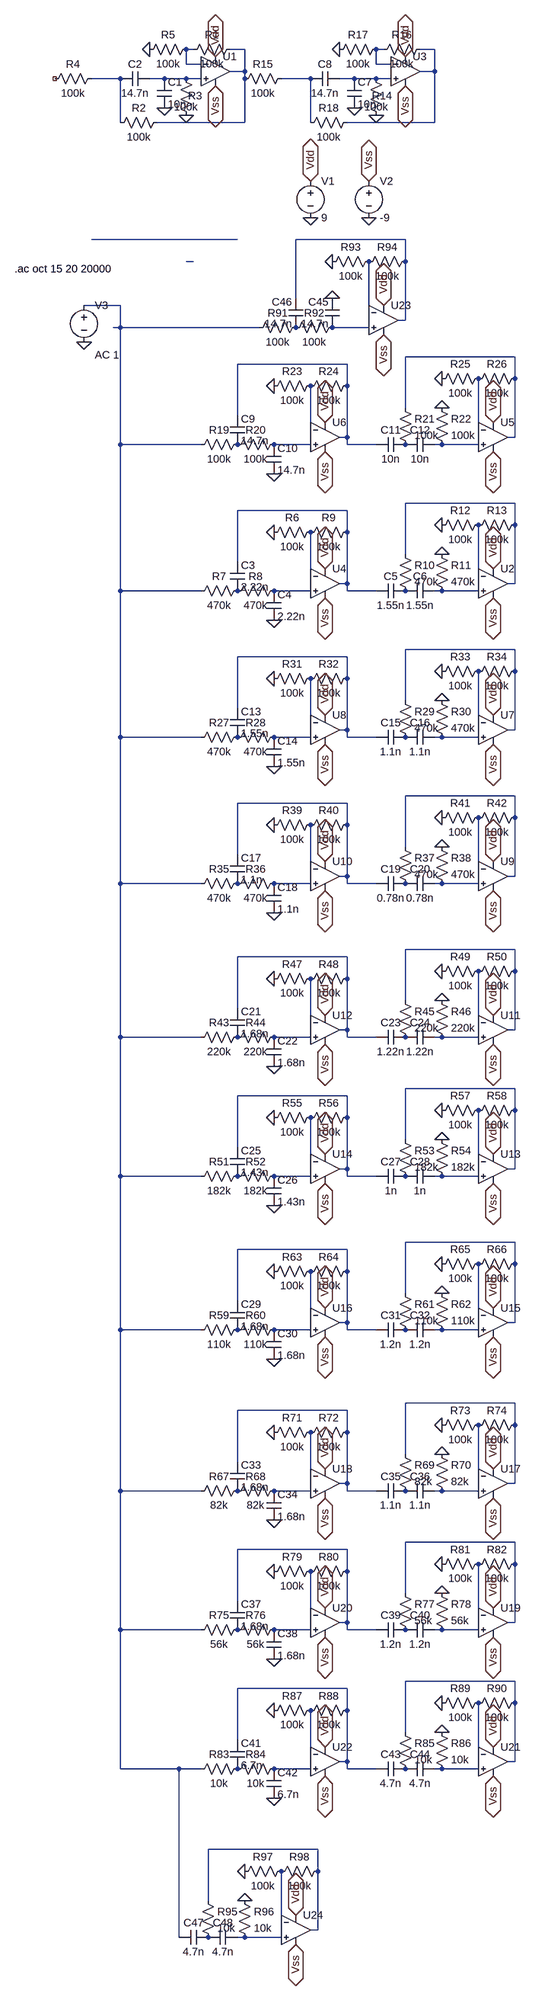
[diagram p0: schematic VocoderFilter.asc]
VocoderFilter.asc, the LTspice schematic file:
Version 4
SHEET 1 1012 3860
WIRE 48 -384 32 -384
WIRE 160 -384 128 -384
WIRE 464 -384 448 -384
WIRE 576 -384 544 -384
WIRE 32 -352 32 -384
WIRE 64 -352 32 -352
WIRE 448 -352 448 -384
WIRE 480 -352 448 -352
WIRE 160 -336 160 -384
WIRE 160 -336 128 -336
WIRE 576 -336 576 -384
WIRE 576 -336 544 -336
WIRE -112 -320 -176 -320
WIRE -16 -320 -48 -320
WIRE 32 -320 -16 -320
WIRE 64 -320 32 -320
WIRE 160 -320 160 -336
WIRE 304 -320 240 -320
WIRE 400 -320 368 -320
WIRE 448 -320 400 -320
WIRE 480 -320 448 -320
WIRE -112 -224 -112 -320
WIRE 160 -224 160 -320
WIRE 160 -224 -32 -224
WIRE 304 -224 304 -320
WIRE 576 -224 576 -336
WIRE 576 -224 384 -224
WIRE 144 32 -176 32
WIRE 512 32 272 32
WIRE 48 80 32 80
WIRE 512 80 512 32
WIRE 272 160 272 32
WIRE -112 176 -192 176
WIRE 432 192 432 80
WIRE 512 208 512 80
WIRE 512 208 496 208
WIRE -112 224 -112 176
WIRE -112 224 -128 224
WIRE 192 224 -112 224
WIRE 432 224 352 224
WIRE 752 288 512 288
WIRE 384 304 144 304
WIRE 752 336 752 288
WIRE 384 352 384 304
WIRE 512 400 512 288
WIRE 144 416 144 304
WIRE 304 448 304 352
WIRE 672 448 672 336
WIRE 384 464 384 352
WIRE 384 464 368 464
WIRE 752 464 752 336
WIRE 752 464 736 464
WIRE -112 480 -112 224
WIRE 64 480 -112 480
WIRE 304 480 224 480
WIRE 384 480 384 464
WIRE 448 480 384 480
WIRE 592 480 576 480
WIRE 672 480 592 480
WIRE 752 608 512 608
WIRE 384 624 144 624
WIRE 752 656 752 608
WIRE 384 672 384 624
WIRE 512 720 512 608
WIRE 144 736 144 624
WIRE 304 768 304 672
WIRE 672 768 672 656
WIRE 384 784 384 672
WIRE 384 784 368 784
WIRE 752 784 752 656
WIRE 752 784 736 784
WIRE -112 800 -112 480
WIRE 64 800 -112 800
WIRE 304 800 224 800
WIRE 384 800 384 784
WIRE 448 800 384 800
WIRE 592 800 576 800
WIRE 672 800 592 800
WIRE 752 928 512 928
WIRE 384 944 144 944
WIRE 752 976 752 928
WIRE 384 992 384 944
WIRE 512 1040 512 928
WIRE 144 1056 144 944
WIRE 304 1088 304 992
WIRE 672 1088 672 976
WIRE 384 1104 384 992
WIRE 384 1104 368 1104
WIRE 752 1104 752 976
WIRE 752 1104 736 1104
WIRE -112 1120 -112 800
WIRE 64 1120 -112 1120
WIRE 304 1120 224 1120
WIRE 384 1120 384 1104
WIRE 448 1120 384 1120
WIRE 592 1120 576 1120
WIRE 672 1120 592 1120
WIRE 752 1248 512 1248
WIRE 384 1264 144 1264
WIRE 752 1296 752 1248
WIRE 384 1312 384 1264
WIRE 512 1360 512 1248
WIRE 144 1376 144 1264
WIRE 304 1408 304 1312
WIRE 672 1408 672 1296
WIRE 384 1424 384 1312
WIRE 384 1424 368 1424
WIRE 752 1424 752 1296
WIRE 752 1424 736 1424
WIRE -112 1440 -112 1120
WIRE 64 1440 -112 1440
WIRE 304 1440 224 1440
WIRE 384 1440 384 1424
WIRE 448 1440 384 1440
WIRE 592 1440 576 1440
WIRE 672 1440 592 1440
WIRE 752 1584 512 1584
WIRE 384 1600 144 1600
WIRE 752 1632 752 1584
WIRE 384 1648 384 1600
WIRE 512 1696 512 1584
WIRE 144 1712 144 1600
WIRE 304 1744 304 1648
WIRE 672 1744 672 1632
WIRE 384 1760 384 1648
WIRE 384 1760 368 1760
WIRE 752 1760 752 1632
WIRE 752 1760 736 1760
WIRE -112 1776 -112 1440
WIRE 64 1776 -112 1776
WIRE 304 1776 224 1776
WIRE 384 1776 384 1760
WIRE 448 1776 384 1776
WIRE 592 1776 576 1776
WIRE 672 1776 592 1776
WIRE 752 1888 512 1888
WIRE 384 1904 144 1904
WIRE 752 1936 752 1888
WIRE 384 1952 384 1904
WIRE 512 2000 512 1888
WIRE 144 2016 144 1904
WIRE 304 2048 304 1952
WIRE 672 2048 672 1936
WIRE 384 2064 384 1952
WIRE 384 2064 368 2064
WIRE 752 2064 752 1936
WIRE 752 2064 736 2064
WIRE -112 2080 -112 1776
WIRE 64 2080 -112 2080
WIRE 304 2080 224 2080
WIRE 384 2080 384 2064
WIRE 448 2080 384 2080
WIRE 592 2080 576 2080
WIRE 672 2080 592 2080
WIRE 752 2224 512 2224
WIRE 384 2240 144 2240
WIRE 752 2272 752 2224
WIRE 384 2288 384 2240
WIRE 512 2336 512 2224
WIRE 144 2352 144 2240
WIRE 304 2384 304 2288
WIRE 672 2384 672 2272
WIRE 384 2400 384 2288
WIRE 384 2400 368 2400
WIRE 752 2400 752 2272
WIRE 752 2400 736 2400
WIRE -112 2416 -112 2080
WIRE 64 2416 -112 2416
WIRE 304 2416 224 2416
WIRE 384 2416 384 2400
WIRE 448 2416 384 2416
WIRE 592 2416 576 2416
WIRE 672 2416 592 2416
WIRE 752 2576 512 2576
WIRE 384 2592 144 2592
WIRE 752 2624 752 2576
WIRE 384 2640 384 2592
WIRE 512 2688 512 2576
WIRE 144 2704 144 2592
WIRE 304 2736 304 2640
WIRE 672 2736 672 2624
WIRE 384 2752 384 2640
WIRE 384 2752 368 2752
WIRE 752 2752 752 2624
WIRE 752 2752 736 2752
WIRE -112 2768 -112 2416
WIRE 64 2768 -112 2768
WIRE 304 2768 224 2768
WIRE 384 2768 384 2752
WIRE 448 2768 384 2768
WIRE 592 2768 576 2768
WIRE 672 2768 592 2768
WIRE 752 2880 512 2880
WIRE 384 2896 144 2896
WIRE 752 2928 752 2880
WIRE 384 2944 384 2896
WIRE 512 2992 512 2880
WIRE 144 3008 144 2896
WIRE 304 3040 304 2944
WIRE 672 3040 672 2928
WIRE 384 3056 384 2944
WIRE 384 3056 368 3056
WIRE 752 3056 752 2928
WIRE 752 3056 736 3056
WIRE -112 3072 -112 2768
WIRE 64 3072 -112 3072
WIRE 304 3072 224 3072
WIRE 384 3072 384 3056
WIRE 448 3072 384 3072
WIRE 592 3072 576 3072
WIRE 672 3072 592 3072
WIRE 752 3184 512 3184
WIRE 384 3200 144 3200
WIRE 752 3232 752 3184
WIRE 384 3248 384 3200
WIRE 512 3296 512 3184
WIRE 144 3312 144 3200
WIRE 304 3344 304 3248
WIRE 672 3344 672 3232
WIRE 384 3360 384 3248
WIRE 384 3360 368 3360
WIRE 752 3360 752 3232
WIRE 752 3360 736 3360
WIRE -112 3376 -112 3072
WIRE 16 3376 -112 3376
WIRE 64 3376 16 3376
WIRE 304 3376 224 3376
WIRE 384 3376 384 3360
WIRE 448 3376 384 3376
WIRE 592 3376 576 3376
WIRE 672 3376 592 3376
WIRE 320 3552 80 3552
WIRE 320 3600 320 3552
WIRE 80 3664 80 3552
WIRE 240 3712 240 3600
WIRE 320 3728 320 3600
WIRE 320 3728 304 3728
WIRE 16 3744 16 3376
WIRE 160 3744 144 3744
WIRE 240 3744 160 3744
FLAG 32 -240 0
FLAG -16 -256 0
FLAG 432 -16 0
FLAG 304 -16 0
FLAG -192 256 0
FLAG -48 -384 0
FLAG 304 -96 Vdd
IOPIN 304 -96 BiDir
FLAG 96 -304 Vss
IOPIN 96 -304 BiDir
FLAG 224 864 0
FLAG 592 720 0
FLAG 432 -96 Vss
IOPIN 432 -96 BiDir
FLAG 96 -368 Vdd
IOPIN 96 -368 BiDir
FLAG 448 -240 0
FLAG 400 -256 0
FLAG 368 -384 0
FLAG 512 -304 Vss
IOPIN 512 -304 BiDir
FLAG 512 -368 Vdd
IOPIN 512 -368 BiDir
FLAG 704 816 Vss
IOPIN 704 816 BiDir
FLAG 704 752 Vdd
IOPIN 704 752 BiDir
FLAG 336 816 Vss
IOPIN 336 816 BiDir
FLAG 336 752 Vdd
IOPIN 336 752 BiDir
FLAG 592 656 0
FLAG 224 672 0
FLAG 224 544 0
FLAG 592 400 0
FLAG 704 496 Vss
IOPIN 704 496 BiDir
FLAG 704 432 Vdd
IOPIN 704 432 BiDir
FLAG 336 496 Vss
IOPIN 336 496 BiDir
FLAG 336 432 Vdd
IOPIN 336 432 BiDir
FLAG 592 336 0
FLAG 224 352 0
FLAG 224 1184 0
FLAG 592 1040 0
FLAG 704 1136 Vss
IOPIN 704 1136 BiDir
FLAG 704 1072 Vdd
IOPIN 704 1072 BiDir
FLAG 336 1136 Vss
IOPIN 336 1136 BiDir
FLAG 336 1072 Vdd
IOPIN 336 1072 BiDir
FLAG 592 976 0
FLAG 224 992 0
FLAG 224 1504 0
FLAG 592 1360 0
FLAG 704 1456 Vss
IOPIN 704 1456 BiDir
FLAG 704 1392 Vdd
IOPIN 704 1392 BiDir
FLAG 336 1456 Vss
IOPIN 336 1456 BiDir
FLAG 336 1392 Vdd
IOPIN 336 1392 BiDir
FLAG 592 1296 0
FLAG 224 1312 0
FLAG 224 1840 0
FLAG 592 1696 0
FLAG 704 1792 Vss
IOPIN 704 1792 BiDir
FLAG 704 1728 Vdd
IOPIN 704 1728 BiDir
FLAG 336 1792 Vss
IOPIN 336 1792 BiDir
FLAG 336 1728 Vdd
IOPIN 336 1728 BiDir
FLAG 592 1632 0
FLAG 224 1648 0
FLAG 224 2144 0
FLAG 592 2000 0
FLAG 704 2096 Vss
IOPIN 704 2096 BiDir
FLAG 704 2032 Vdd
IOPIN 704 2032 BiDir
FLAG 336 2096 Vss
IOPIN 336 2096 BiDir
FLAG 336 2032 Vdd
IOPIN 336 2032 BiDir
FLAG 592 1936 0
FLAG 224 1952 0
FLAG 224 2480 0
FLAG 592 2336 0
FLAG 704 2432 Vss
IOPIN 704 2432 BiDir
FLAG 704 2368 Vdd
IOPIN 704 2368 BiDir
FLAG 336 2432 Vss
IOPIN 336 2432 BiDir
FLAG 336 2368 Vdd
IOPIN 336 2368 BiDir
FLAG 592 2272 0
FLAG 224 2288 0
FLAG 224 2832 0
FLAG 592 2688 0
FLAG 704 2784 Vss
IOPIN 704 2784 BiDir
FLAG 704 2720 Vdd
IOPIN 704 2720 BiDir
FLAG 336 2784 Vss
IOPIN 336 2784 BiDir
FLAG 336 2720 Vdd
IOPIN 336 2720 BiDir
FLAG 592 2624 0
FLAG 224 2640 0
FLAG 224 3136 0
FLAG 592 2992 0
FLAG 704 3088 Vss
IOPIN 704 3088 BiDir
FLAG 704 3024 Vdd
IOPIN 704 3024 BiDir
FLAG 336 3088 Vss
IOPIN 336 3088 BiDir
FLAG 336 3024 Vdd
IOPIN 336 3024 BiDir
FLAG 592 2928 0
FLAG 224 2944 0
FLAG 224 3440 0
FLAG 592 3296 0
FLAG 704 3392 Vss
IOPIN 704 3392 BiDir
FLAG 704 3328 Vdd
IOPIN 704 3328 BiDir
FLAG 336 3392 Vss
IOPIN 336 3392 BiDir
FLAG 336 3328 Vdd
IOPIN 336 3328 BiDir
FLAG 592 3232 0
FLAG 224 3248 0
FLAG 352 160 0
FLAG 464 240 Vss
IOPIN 464 240 BiDir
FLAG 464 176 Vdd
IOPIN 464 176 BiDir
FLAG 352 80 0
FLAG 160 3664 0
FLAG 272 3760 Vss
IOPIN 272 3760 BiDir
FLAG 272 3696 Vdd
IOPIN 272 3696 BiDir
FLAG 160 3600 0
SYMBOL res 48 -224 R180
WINDOW 0 -19 58 Left 2
WINDOW 3 -10 34 Left 2
SYMATTR InstName R3
SYMATTR Value 100k
SYMBOL cap -32 -320 R0
SYMATTR InstName C1
SYMATTR Value 10n
SYMBOL cap -48 -336 R90
WINDOW 0 0 32 VBottom 2
WINDOW 3 32 32 VTop 2
SYMATTR InstName C2
SYMATTR Value 14.7n
SYMBOL res -160 -336 R90
WINDOW 0 0 56 VBottom 2
WINDOW 3 32 56 VTop 2
SYMATTR InstName R4
SYMATTR Value 100k
SYMBOL voltage 304 -112 R0
WINDOW 123 0 0 Left 0
WINDOW 39 0 0 Left 0
SYMATTR InstName V1
SYMATTR Value 9
SYMBOL voltage 432 -112 R0
WINDOW 123 0 0 Left 0
WINDOW 39 0 0 Left 0
SYMATTR InstName V2
SYMATTR Value -9
SYMBOL voltage -192 160 R0
WINDOW 123 24 124 Left 2
WINDOW 39 0 0 Left 0
SYMATTR Value2 AC 1
SYMATTR InstName V3
SYMATTR Value ""
SYMBOL Opamps\\UniversalOpamp2 96 -336 R0
SYMATTR InstName U1
SYMBOL res 144 -400 R90
WINDOW 0 0 56 VBottom 2
WINDOW 3 32 56 VTop 2
SYMATTR InstName R1
SYMATTR Value 100k
SYMBOL res 48 -400 R90
WINDOW 0 0 56 VBottom 2
WINDOW 3 32 56 VTop 2
SYMATTR InstName R5
SYMATTR Value 100k
SYMBOL res -16 -240 R90
WINDOW 0 0 56 VBottom 2
WINDOW 3 32 56 VTop 2
SYMATTR InstName R2
SYMATTR Value 100k
SYMBOL cap 128 736 R0
SYMATTR InstName C3
SYMATTR Value 2.22n
SYMBOL res 160 784 R90
WINDOW 0 0 56 VBottom 2
WINDOW 3 32 56 VTop 2
SYMATTR InstName R7
SYMATTR Value 470k
SYMBOL cap 208 800 R0
SYMATTR InstName C4
SYMATTR Value 2.22n
SYMBOL res 240 784 R90
WINDOW 0 0 56 VBottom 2
WINDOW 3 32 56 VTop 2
SYMATTR InstName R8
SYMATTR Value 470k
SYMBOL res 496 704 R0
SYMATTR InstName R10
SYMATTR Value 470k
SYMBOL cap 512 784 R90
WINDOW 0 0 32 VBottom 2
WINDOW 3 32 32 VTop 2
SYMATTR InstName C5
SYMATTR Value 1.55n
SYMBOL cap 576 784 R90
WINDOW 0 0 32 VBottom 2
WINDOW 3 32 32 VTop 2
SYMATTR InstName C6
SYMATTR Value 1.55n
SYMBOL res 576 704 R0
SYMATTR InstName R11
SYMATTR Value 470k
SYMBOL res 464 -224 R180
WINDOW 0 -19 58 Left 2
WINDOW 3 -10 34 Left 2
SYMATTR InstName R14
SYMATTR Value 100k
SYMBOL cap 384 -320 R0
SYMATTR InstName C7
SYMATTR Value 10n
SYMBOL cap 368 -336 R90
WINDOW 0 0 32 VBottom 2
WINDOW 3 32 32 VTop 2
SYMATTR InstName C8
SYMATTR Value 14.7n
SYMBOL res 256 -336 R90
WINDOW 0 0 56 VBottom 2
WINDOW 3 32 56 VTop 2
SYMATTR InstName R15
SYMATTR Value 100k
SYMBOL Opamps\\UniversalOpamp2 512 -336 R0
SYMATTR InstName U3
SYMBOL res 560 -400 R90
WINDOW 0 0 56 VBottom 2
WINDOW 3 32 56 VTop 2
SYMATTR InstName R16
SYMATTR Value 100k
SYMBOL res 464 -400 R90
WINDOW 0 0 56 VBottom 2
WINDOW 3 32 56 VTop 2
SYMATTR InstName R17
SYMATTR Value 100k
SYMBOL res 400 -240 R90
WINDOW 0 0 56 VBottom 2
WINDOW 3 32 56 VTop 2
SYMATTR InstName R18
SYMATTR Value 100k
SYMBOL Opamps\\UniversalOpamp2 704 784 R0
SYMATTR InstName U2
SYMBOL Opamps\\UniversalOpamp2 336 784 R0
SYMATTR InstName U4
SYMBOL res 320 656 R90
WINDOW 0 0 56 VBottom 2
WINDOW 3 32 56 VTop 2
SYMATTR InstName R6
SYMATTR Value 100k
SYMBOL res 400 656 R90
WINDOW 0 0 56 VBottom 2
WINDOW 3 32 56 VTop 2
SYMATTR InstName R9
SYMATTR Value 100k
SYMBOL res 688 640 R90
WINDOW 0 0 56 VBottom 2
WINDOW 3 32 56 VTop 2
SYMATTR InstName R12
SYMATTR Value 100k
SYMBOL res 768 640 R90
WINDOW 0 0 56 VBottom 2
WINDOW 3 32 56 VTop 2
SYMATTR InstName R13
SYMATTR Value 100k
SYMBOL cap 128 416 R0
SYMATTR InstName C9
SYMATTR Value 14.7n
SYMBOL res 160 464 R90
WINDOW 0 0 56 VBottom 2
WINDOW 3 32 56 VTop 2
SYMATTR InstName R19
SYMATTR Value 100k
SYMBOL cap 208 480 R0
SYMATTR InstName C10
SYMATTR Value 14.7n
SYMBOL res 240 464 R90
WINDOW 0 0 56 VBottom 2
WINDOW 3 32 56 VTop 2
SYMATTR InstName R20
SYMATTR Value 100k
SYMBOL res 496 384 R0
SYMATTR InstName R21
SYMATTR Value 100k
SYMBOL cap 512 464 R90
WINDOW 0 0 32 VBottom 2
WINDOW 3 32 32 VTop 2
SYMATTR InstName C11
SYMATTR Value 10n
SYMBOL cap 576 464 R90
WINDOW 0 0 32 VBottom 2
WINDOW 3 32 32 VTop 2
SYMATTR InstName C12
SYMATTR Value 10n
SYMBOL res 576 384 R0
SYMATTR InstName R22
SYMATTR Value 100k
SYMBOL Opamps\\UniversalOpamp2 704 464 R0
SYMATTR InstName U5
SYMBOL Opamps\\UniversalOpamp2 336 464 R0
SYMATTR InstName U6
SYMBOL res 320 336 R90
WINDOW 0 0 56 VBottom 2
WINDOW 3 32 56 VTop 2
SYMATTR InstName R23
SYMATTR Value 100k
SYMBOL res 400 336 R90
WINDOW 0 0 56 VBottom 2
WINDOW 3 32 56 VTop 2
SYMATTR InstName R24
SYMATTR Value 100k
SYMBOL res 688 320 R90
WINDOW 0 0 56 VBottom 2
WINDOW 3 32 56 VTop 2
SYMATTR InstName R25
SYMATTR Value 100k
SYMBOL res 768 320 R90
WINDOW 0 0 56 VBottom 2
WINDOW 3 32 56 VTop 2
SYMATTR InstName R26
SYMATTR Value 100k
SYMBOL cap 128 1056 R0
SYMATTR InstName C13
SYMATTR Value 1.55n
SYMBOL res 160 1104 R90
WINDOW 0 0 56 VBottom 2
WINDOW 3 32 56 VTop 2
SYMATTR InstName R27
SYMATTR Value 470k
SYMBOL cap 208 1120 R0
SYMATTR InstName C14
SYMATTR Value 1.55n
SYMBOL res 240 1104 R90
WINDOW 0 0 56 VBottom 2
WINDOW 3 32 56 VTop 2
SYMATTR InstName R28
SYMATTR Value 470k
SYMBOL res 496 1024 R0
SYMATTR InstName R29
SYMATTR Value 470k
SYMBOL cap 512 1104 R90
WINDOW 0 0 32 VBottom 2
WINDOW 3 32 32 VTop 2
SYMATTR InstName C15
SYMATTR Value 1.1n
SYMBOL cap 576 1104 R90
WINDOW 0 0 32 VBottom 2
WINDOW 3 32 32 VTop 2
SYMATTR InstName C16
SYMATTR Value 1.1n
SYMBOL res 576 1024 R0
SYMATTR InstName R30
SYMATTR Value 470k
SYMBOL Opamps\\UniversalOpamp2 704 1104 R0
SYMATTR InstName U7
SYMBOL Opamps\\UniversalOpamp2 336 1104 R0
SYMATTR InstName U8
SYMBOL res 320 976 R90
WINDOW 0 0 56 VBottom 2
WINDOW 3 32 56 VTop 2
SYMATTR InstName R31
SYMATTR Value 100k
SYMBOL res 400 976 R90
WINDOW 0 0 56 VBottom 2
WINDOW 3 32 56 VTop 2
SYMATTR InstName R32
SYMATTR Value 100k
SYMBOL res 688 960 R90
WINDOW 0 0 56 VBottom 2
WINDOW 3 32 56 VTop 2
SYMATTR InstName R33
SYMATTR Value 100k
SYMBOL res 768 960 R90
WINDOW 0 0 56 VBottom 2
WINDOW 3 32 56 VTop 2
SYMATTR InstName R34
SYMATTR Value 100k
SYMBOL cap 128 1376 R0
SYMATTR InstName C17
SYMATTR Value 1.1n
SYMBOL res 160 1424 R90
WINDOW 0 0 56 VBottom 2
WINDOW 3 32 56 VTop 2
SYMATTR InstName R35
SYMATTR Value 470k
SYMBOL cap 208 1440 R0
SYMATTR InstName C18
SYMATTR Value 1.1n
SYMBOL res 240 1424 R90
WINDOW 0 0 56 VBottom 2
WINDOW 3 32 56 VTop 2
SYMATTR InstName R36
SYMATTR Value 470k
SYMBOL res 496 1344 R0
SYMATTR InstName R37
SYMATTR Value 470k
SYMBOL cap 512 1424 R90
WINDOW 0 0 32 VBottom 2
WINDOW 3 32 32 VTop 2
SYMATTR InstName C19
SYMATTR Value 0.78n
SYMBOL cap 576 1424 R90
WINDOW 0 0 32 VBottom 2
WINDOW 3 32 32 VTop 2
SYMATTR InstName C20
SYMATTR Value 0.78n
SYMBOL res 576 1344 R0
SYMATTR InstName R38
SYMATTR Value 470k
SYMBOL Opamps\\UniversalOpamp2 704 1424 R0
SYMATTR InstName U9
SYMBOL Opamps\\UniversalOpamp2 336 1424 R0
SYMATTR InstName U10
SYMBOL res 320 1296 R90
WINDOW 0 0 56 VBottom 2
WINDOW 3 32 56 VTop 2
SYMATTR InstName R39
SYMATTR Value 100k
SYMBOL res 400 1296 R90
WINDOW 0 0 56 VBottom 2
WINDOW 3 32 56 VTop 2
SYMATTR InstName R40
SYMATTR Value 100k
SYMBOL res 688 1280 R90
WINDOW 0 0 56 VBottom 2
WINDOW 3 32 56 VTop 2
SYMATTR InstName R41
SYMATTR Value 100k
SYMBOL res 768 1280 R90
WINDOW 0 0 56 VBottom 2
WINDOW 3 32 56 VTop 2
SYMATTR InstName R42
SYMATTR Value 100k
SYMBOL cap 128 1712 R0
SYMATTR InstName C21
SYMATTR Value 1.68n
SYMBOL res 160 1760 R90
WINDOW 0 0 56 VBottom 2
WINDOW 3 32 56 VTop 2
SYMATTR InstName R43
SYMATTR Value 220k
SYMBOL cap 208 1776 R0
SYMATTR InstName C22
SYMATTR Value 1.68n
SYMBOL res 240 1760 R90
WINDOW 0 0 56 VBottom 2
WINDOW 3 32 56 VTop 2
SYMATTR InstName R44
SYMATTR Value 220k
SYMBOL res 496 1680 R0
SYMATTR InstName R45
SYMATTR Value 220k
SYMBOL cap 512 1760 R90
WINDOW 0 0 32 VBottom 2
WINDOW 3 32 32 VTop 2
SYMATTR InstName C23
SYMATTR Value 1.22n
SYMBOL cap 576 1760 R90
WINDOW 0 0 32 VBottom 2
WINDOW 3 32 32 VTop 2
SYMATTR InstName C24
SYMATTR Value 1.22n
SYMBOL res 576 1680 R0
SYMATTR InstName R46
SYMATTR Value 220k
SYMBOL Opamps\\UniversalOpamp2 704 1760 R0
SYMATTR InstName U11
SYMBOL Opamps\\UniversalOpamp2 336 1760 R0
SYMATTR InstName U12
SYMBOL res 320 1632 R90
WINDOW 0 0 56 VBottom 2
WINDOW 3 32 56 VTop 2
SYMATTR InstName R47
SYMATTR Value 100k
SYMBOL res 400 1632 R90
WINDOW 0 0 56 VBottom 2
WINDOW 3 32 56 VTop 2
SYMATTR InstName R48
SYMATTR Value 100k
SYMBOL res 688 1616 R90
WINDOW 0 0 56 VBottom 2
WINDOW 3 32 56 VTop 2
SYMATTR InstName R49
SYMATTR Value 100k
SYMBOL res 768 1616 R90
WINDOW 0 0 56 VBottom 2
WINDOW 3 32 56 VTop 2
SYMATTR InstName R50
SYMATTR Value 100k
SYMBOL cap 128 2016 R0
SYMATTR InstName C25
SYMATTR Value 1.43n
SYMBOL res 160 2064 R90
WINDOW 0 0 56 VBottom 2
WINDOW 3 32 56 VTop 2
SYMATTR InstName R51
SYMATTR Value 182k
SYMBOL cap 208 2080 R0
SYMATTR InstName C26
SYMATTR Value 1.43n
SYMBOL res 240 2064 R90
WINDOW 0 0 56 VBottom 2
WINDOW 3 32 56 VTop 2
SYMATTR InstName R52
SYMATTR Value 182k
SYMBOL res 496 1984 R0
SYMATTR InstName R53
SYMATTR Value 182k
SYMBOL cap 512 2064 R90
WINDOW 0 0 32 VBottom 2
WINDOW 3 32 32 VTop 2
SYMATTR InstName C27
SYMATTR Value 1n
SYMBOL cap 576 2064 R90
WINDOW 0 0 32 VBottom 2
WINDOW 3 32 32 VTop 2
SYMATTR InstName C28
SYMATTR Value 1n
SYMBOL res 576 1984 R0
SYMATTR InstName R54
SYMATTR Value 182k
SYMBOL Opamps\\UniversalOpamp2 704 2064 R0
SYMATTR InstName U13
SYMBOL Opamps\\UniversalOpamp2 336 2064 R0
SYMATTR InstName U14
SYMBOL res 320 1936 R90
WINDOW 0 0 56 VBottom 2
WINDOW 3 32 56 VTop 2
SYMATTR InstName R55
SYMATTR Value 100k
SYMBOL res 400 1936 R90
WINDOW 0 0 56 VBottom 2
WINDOW 3 32 56 VTop 2
SYMATTR InstName R56
SYMATTR Value 100k
SYMBOL res 688 1920 R90
WINDOW 0 0 56 VBottom 2
WINDOW 3 32 56 VTop 2
SYMATTR InstName R57
SYMATTR Value 100k
SYMBOL res 768 1920 R90
WINDOW 0 0 56 VBottom 2
WINDOW 3 32 56 VTop 2
SYMATTR InstName R58
SYMATTR Value 100k
SYMBOL cap 128 2352 R0
SYMATTR InstName C29
SYMATTR Value 1.68n
SYMBOL res 160 2400 R90
WINDOW 0 0 56 VBottom 2
WINDOW 3 32 56 VTop 2
SYMATTR InstName R59
SYMATTR Value 110k
SYMBOL cap 208 2416 R0
SYMATTR InstName C30
SYMATTR Value 1.68n
SYMBOL res 240 2400 R90
WINDOW 0 0 56 VBottom 2
WINDOW 3 32 56 VTop 2
SYMATTR InstName R60
SYMATTR Value 110k
SYMBOL res 496 2320 R0
SYMATTR InstName R61
SYMATTR Value 110k
SYMBOL cap 512 2400 R90
WINDOW 0 0 32 VBottom 2
WINDOW 3 32 32 VTop 2
SYMATTR InstName C31
SYMATTR Value 1.2n
SYMBOL cap 576 2400 R90
WINDOW 0 0 32 VBottom 2
WINDOW 3 32 32 VTop 2
SYMATTR InstName C32
SYMATTR Value 1.2n
SYMBOL res 576 2320 R0
SYMATTR InstName R62
SYMATTR Value 110k
SYMBOL Opamps\\UniversalOpamp2 704 2400 R0
SYMATTR InstName U15
SYMBOL Opamps\\UniversalOpamp2 336 2400 R0
SYMATTR InstName U16
SYMBOL res 320 2272 R90
WINDOW 0 0 56 VBottom 2
WINDOW 3 32 56 VTop 2
SYMATTR InstName R63
SYMATTR Value 100k
SYMBOL res 400 2272 R90
WINDOW 0 0 56 VBottom 2
WINDOW 3 32 56 VTop 2
SYMATTR InstName R64
SYMATTR Value 100k
SYMBOL res 688 2256 R90
WINDOW 0 0 56 VBottom 2
WINDOW 3 32 56 VTop 2
SYMATTR InstName R65
SYMATTR Value 100k
SYMBOL res 768 2256 R90
WINDOW 0 0 56 VBottom 2
WINDOW 3 32 56 VTop 2
SYMATTR InstName R66
SYMATTR Value 100k
SYMBOL cap 128 2704 R0
SYMATTR InstName C33
SYMATTR Value 1.68n
SYMBOL res 160 2752 R90
WINDOW 0 0 56 VBottom 2
WINDOW 3 32 56 VTop 2
SYMATTR InstName R67
SYMATTR Value 82k
SYMBOL cap 208 2768 R0
SYMATTR InstName C34
SYMATTR Value 1.68n
SYMBOL res 240 2752 R90
WINDOW 0 0 56 VBottom 2
WINDOW 3 32 56 VTop 2
SYMATTR InstName R68
SYMATTR Value 82k
SYMBOL res 496 2672 R0
SYMATTR InstName R69
SYMATTR Value 82k
SYMBOL cap 512 2752 R90
WINDOW 0 0 32 VBottom 2
WINDOW 3 32 32 VTop 2
SYMATTR InstName C35
SYMATTR Value 1.1n
SYMBOL cap 576 2752 R90
WINDOW 0 0 32 VBottom 2
WINDOW 3 32 32 VTop 2
SYMATTR InstName C36
SYMATTR Value 1.1n
SYMBOL res 576 2672 R0
SYMATTR InstName R70
SYMATTR Value 82k
SYMBOL Opamps\\UniversalOpamp2 704 2752 R0
SYMATTR InstName U17
SYMBOL Opamps\\UniversalOpamp2 336 2752 R0
SYMATTR InstName U18
SYMBOL res 320 2624 R90
WINDOW 0 0 56 VBottom 2
WINDOW 3 32 56 VTop 2
SYMATTR InstName R71
SYMATTR Value 100k
SYMBOL res 400 2624 R90
WINDOW 0 0 56 VBottom 2
WINDOW 3 32 56 VTop 2
SYMATTR InstName R72
SYMATTR Value 100k
SYMBOL res 688 2608 R90
WINDOW 0 0 56 VBottom 2
WINDOW 3 32 56 VTop 2
SYMATTR InstName R73
SYMATTR Value 100k
SYMBOL res 768 2608 R90
WINDOW 0 0 56 VBottom 2
WINDOW 3 32 56 VTop 2
SYMATTR InstName R74
SYMATTR Value 100k
SYMBOL cap 128 3008 R0
SYMATTR InstName C37
SYMATTR Value 1.68n
SYMBOL res 160 3056 R90
WINDOW 0 0 56 VBottom 2
WINDOW 3 32 56 VTop 2
SYMATTR InstName R75
SYMATTR Value 56k
SYMBOL cap 208 3072 R0
SYMATTR InstName C38
SYMATTR Value 1.68n
SYMBOL res 240 3056 R90
WINDOW 0 0 56 VBottom 2
WINDOW 3 32 56 VTop 2
SYMATTR InstName R76
SYMATTR Value 56k
SYMBOL res 496 2976 R0
SYMATTR InstName R77
SYMATTR Value 56k
SYMBOL cap 512 3056 R90
WINDOW 0 0 32 VBottom 2
WINDOW 3 32 32 VTop 2
SYMATTR InstName C39
SYMATTR Value 1.2n
SYMBOL cap 576 3056 R90
WINDOW 0 0 32 VBottom 2
WINDOW 3 32 32 VTop 2
SYMATTR InstName C40
SYMATTR Value 1.2n
SYMBOL res 576 2976 R0
SYMATTR InstName R78
SYMATTR Value 56k
SYMBOL Opamps\\UniversalOpamp2 704 3056 R0
SYMATTR InstName U19
SYMBOL Opamps\\UniversalOpamp2 336 3056 R0
SYMATTR InstName U20
SYMBOL res 320 2928 R90
WINDOW 0 0 56 VBottom 2
WINDOW 3 32 56 VTop 2
SYMATTR InstName R79
SYMATTR Value 100k
SYMBOL res 400 2928 R90
WINDOW 0 0 56 VBottom 2
WINDOW 3 32 56 VTop 2
SYMATTR InstName R80
SYMATTR Value 100k
SYMBOL res 688 2912 R90
WINDOW 0 0 56 VBottom 2
WINDOW 3 32 56 VTop 2
SYMATTR InstName R81
SYMATTR Value 100k
SYMBOL res 768 2912 R90
WINDOW 0 0 56 VBottom 2
WINDOW 3 32 56 VTop 2
SYMATTR InstName R82
SYMATTR Value 100k
SYMBOL cap 128 3312 R0
SYMATTR InstName C41
SYMATTR Value 6.7n
SYMBOL res 160 3360 R90
WINDOW 0 0 56 VBottom 2
WINDOW 3 32 56 VTop 2
SYMATTR InstName R83
SYMATTR Value 10k
SYMBOL cap 208 3376 R0
SYMATTR InstName C42
SYMATTR Value 6.7n
SYMBOL res 240 3360 R90
WINDOW 0 0 56 VBottom 2
WINDOW 3 32 56 VTop 2
SYMATTR InstName R84
SYMATTR Value 10k
SYMBOL res 496 3280 R0
SYMATTR InstName R85
SYMATTR Value 10k
SYMBOL cap 512 3360 R90
WINDOW 0 0 32 VBottom 2
WINDOW 3 32 32 VTop 2
SYMATTR InstName C43
SYMATTR Value 4.7n
SYMBOL cap 576 3360 R90
WINDOW 0 0 32 VBottom 2
WINDOW 3 32 32 VTop 2
SYMATTR InstName C44
SYMATTR Value 4.7n
SYMBOL res 576 3280 R0
SYMATTR InstName R86
SYMATTR Value 10k
SYMBOL Opamps\\UniversalOpamp2 704 3360 R0
SYMATTR InstName U21
SYMBOL Opamps\\UniversalOpamp2 336 3360 R0
SYMATTR InstName U22
SYMBOL res 320 3232 R90
WINDOW 0 0 56 VBottom 2
WINDOW 3 32 56 VTop 2
SYMATTR InstName R87
SYMATTR Value 100k
SYMBOL res 400 3232 R90
WINDOW 0 0 56 VBottom 2
WINDOW 3 32 56 VTop 2
SYMATTR InstName R88
SYMATTR Value 100k
SYMBOL res 688 3216 R90
WINDOW 0 0 56 VBottom 2
WINDOW 3 32 56 VTop 2
SYMATTR InstName R89
SYMATTR Value 100k
SYMBOL res 768 3216 R90
WINDOW 0 0 56 VBottom 2
WINDOW 3 32 56 VTop 2
SYMATTR InstName R90
SYMATTR Value 100k
SYMBOL res 288 208 R90
WINDOW 0 0 56 VBottom 2
WINDOW 3 32 56 VTop 2
SYMATTR InstName R91
SYMATTR Value 100k
SYMBOL cap 368 224 R180
WINDOW 0 24 56 Left 2
WINDOW 3 24 8 Left 2
SYMATTR InstName C45
SYMATTR Value 14.7n
SYMBOL cap 288 224 R180
WINDOW 0 24 56 Left 2
WINDOW 3 24 8 Left 2
SYMATTR InstName C46
SYMATTR Value 14.7n
SYMBOL res 368 208 R90
WINDOW 0 0 56 VBottom 2
WINDOW 3 32 56 VTop 2
SYMATTR InstName R92
SYMATTR Value 100k
SYMBOL Opamps\\UniversalOpamp2 464 208 R0
SYMATTR InstName U23
SYMBOL res 448 64 R90
WINDOW 0 0 56 VBottom 2
WINDOW 3 32 56 VTop 2
SYMATTR InstName R93
SYMATTR Value 100k
SYMBOL res 528 64 R90
WINDOW 0 0 56 VBottom 2
WINDOW 3 32 56 VTop 2
SYMATTR InstName R94
SYMATTR Value 100k
SYMBOL res 64 3648 R0
SYMATTR InstName R95
SYMATTR Value 10k
SYMBOL cap 80 3728 R90
WINDOW 0 0 32 VBottom 2
WINDOW 3 32 32 VTop 2
SYMATTR InstName C47
SYMATTR Value 4.7n
SYMBOL cap 144 3728 R90
WINDOW 0 0 32 VBottom 2
WINDOW 3 32 32 VTop 2
SYMATTR InstName C48
SYMATTR Value 4.7n
SYMBOL res 144 3648 R0
SYMATTR InstName R96
SYMATTR Value 10k
SYMBOL Opamps\\UniversalOpamp2 272 3728 R0
SYMATTR InstName U24
SYMBOL res 256 3584 R90
WINDOW 0 0 56 VBottom 2
WINDOW 3 32 56 VTop 2
SYMATTR InstName R97
SYMATTR Value 100k
SYMBOL res 336 3584 R90
WINDOW 0 0 56 VBottom 2
WINDOW 3 32 56 VTop 2
SYMATTR InstName R98
SYMATTR Value 100k
TEXT -344 96 Left 2 !.ac oct 15 20 20000

The netlist it stands for:
* VocoderFilter.asc
R3 0 N006 100k
C1 N006 0 10n
C2 N006 N005 14.7n
R4 N005 NC_01 100k
V1 Vdd 0 9
V2 Vss 0 -9
V3 N012 0 AC 1
XU1 N006 N001 Vdd Vss N002 level.2 Avol=1Meg GBW=10Meg Slew=10Meg ilimit=25m rail=0 Vos=0 phimargin=45 en=0 enk=0 in=0 ink=0 Rin=500Meg  ; pins IN+ IN- V+ V- OUT
R1 N002 N001 100k
R5 N001 0 100k
R2 N002 N005 100k
C3 N022 P001 2.22n
R7 P001 N012 470k
C4 N025 0 2.22n
R8 N025 P001 470k
R10 N021 P002 470k
C5 P002 N022 1.55n
C6 N026 P002 1.55n
R11 0 N026 470k
R14 0 N008 100k
C7 N008 0 10n
C8 N008 N007 14.7n
R15 N007 N002 100k
XU3 N008 N003 Vdd Vss N004 level.2 Avol=1Meg GBW=10Meg Slew=10Meg ilimit=25m rail=0 Vos=0 phimargin=45 en=0 enk=0 in=0 ink=0 Rin=500Meg  ; pins IN+ IN- V+ V- OUT
R16 N004 N003 100k
R17 N003 0 100k
R18 N004 N007 100k
XU2 N026 N024 Vdd Vss N021 level.2 Avol=1Meg GBW=10Meg Slew=10Meg ilimit=25m rail=0 Vos=0 phimargin=45 en=0 enk=0 in=0 ink=0 Rin=500Meg  ; pins IN+ IN- V+ V- OUT
XU4 N025 N023 Vdd Vss N022 level.2 Avol=1Meg GBW=10Meg Slew=10Meg ilimit=25m rail=0 Vos=0 phimargin=45 en=0 enk=0 in=0 ink=0 Rin=500Meg  ; pins IN+ IN- V+ V- OUT
R6 N023 0 100k
R9 N022 N023 100k
R12 N024 0 100k
R13 N021 N024 100k
C9 N016 P003 14.7n
R19 P003 N012 100k
C10 N019 0 14.7n
R20 N019 P003 100k
R21 N015 P004 100k
C11 P004 N016 10n
C12 N020 P004 10n
R22 0 N020 100k
XU5 N020 N018 Vdd Vss N015 level.2 Avol=1Meg GBW=10Meg Slew=10Meg ilimit=25m rail=0 Vos=0 phimargin=45 en=0 enk=0 in=0 ink=0 Rin=500Meg  ; pins IN+ IN- V+ V- OUT
XU6 N019 N017 Vdd Vss N016 level.2 Avol=1Meg GBW=10Meg Slew=10Meg ilimit=25m rail=0 Vos=0 phimargin=45 en=0 enk=0 in=0 ink=0 Rin=500Meg  ; pins IN+ IN- V+ V- OUT
R23 N017 0 100k
R24 N016 N017 100k
R25 N018 0 100k
R26 N015 N018 100k
C13 N028 P005 1.55n
R27 P005 N012 470k
C14 N031 0 1.55n
R28 N031 P005 470k
R29 N027 P006 470k
C15 P006 N028 1.1n
C16 N032 P006 1.1n
R30 0 N032 470k
XU7 N032 N030 Vdd Vss N027 level.2 Avol=1Meg GBW=10Meg Slew=10Meg ilimit=25m rail=0 Vos=0 phimargin=45 en=0 enk=0 in=0 ink=0 Rin=500Meg  ; pins IN+ IN- V+ V- OUT
XU8 N031 N029 Vdd Vss N028 level.2 Avol=1Meg GBW=10Meg Slew=10Meg ilimit=25m rail=0 Vos=0 phimargin=45 en=0 enk=0 in=0 ink=0 Rin=500Meg  ; pins IN+ IN- V+ V- OUT
R31 N029 0 100k
R32 N028 N029 100k
R33 N030 0 100k
R34 N027 N030 100k
C17 N034 P007 1.1n
R35 P007 N012 470k
C18 N037 0 1.1n
R36 N037 P007 470k
R37 N033 P008 470k
C19 P008 N034 0.78n
C20 N038 P008 0.78n
R38 0 N038 470k
XU9 N038 N036 Vdd Vss N033 level.2 Avol=1Meg GBW=10Meg Slew=10Meg ilimit=25m rail=0 Vos=0 phimargin=45 en=0 enk=0 in=0 ink=0 Rin=500Meg  ; pins IN+ IN- V+ V- OUT
XU10 N037 N035 Vdd Vss N034 level.2 Avol=1Meg GBW=10Meg Slew=10Meg ilimit=25m rail=0 Vos=0 phimargin=45 en=0 enk=0 in=0 ink=0 Rin=500Meg  ; pins IN+ IN- V+ V- OUT
R39 N035 0 100k
R40 N034 N035 100k
R41 N036 0 100k
R42 N033 N036 100k
C21 N040 P009 1.68n
R43 P009 N012 220k
C22 N043 0 1.68n
R44 N043 P009 220k
R45 N039 P010 220k
C23 P010 N040 1.22n
C24 N044 P010 1.22n
R46 0 N044 220k
XU11 N044 N042 Vdd Vss N039 level.2 Avol=1Meg GBW=10Meg Slew=10Meg ilimit=25m rail=0 Vos=0 phimargin=45 en=0 enk=0 in=0 ink=0 Rin=500Meg  ; pins IN+ IN- V+ V- OUT
XU12 N043 N041 Vdd Vss N040 level.2 Avol=1Meg GBW=10Meg Slew=10Meg ilimit=25m rail=0 Vos=0 phimargin=45 en=0 enk=0 in=0 ink=0 Rin=500Meg  ; pins IN+ IN- V+ V- OUT
R47 N041 0 100k
R48 N040 N041 100k
R49 N042 0 100k
R50 N039 N042 100k
C25 N046 P011 1.43n
R51 P011 N012 182k
C26 N049 0 1.43n
R52 N049 P011 182k
R53 N045 P012 182k
C27 P012 N046 1n
C28 N050 P012 1n
R54 0 N050 182k
XU13 N050 N048 Vdd Vss N045 level.2 Avol=1Meg GBW=10Meg Slew=10Meg ilimit=25m rail=0 Vos=0 phimargin=45 en=0 enk=0 in=0 ink=0 Rin=500Meg  ; pins IN+ IN- V+ V- OUT
XU14 N049 N047 Vdd Vss N046 level.2 Avol=1Meg GBW=10Meg Slew=10Meg ilimit=25m rail=0 Vos=0 phimargin=45 en=0 enk=0 in=0 ink=0 Rin=500Meg  ; pins IN+ IN- V+ V- OUT
R55 N047 0 100k
R56 N046 N047 100k
R57 N048 0 100k
R58 N045 N048 100k
C29 N052 P013 1.68n
R59 P013 N012 110k
C30 N055 0 1.68n
R60 N055 P013 110k
R61 N051 P014 110k
C31 P014 N052 1.2n
C32 N056 P014 1.2n
R62 0 N056 110k
XU15 N056 N054 Vdd Vss N051 level.2 Avol=1Meg GBW=10Meg Slew=10Meg ilimit=25m rail=0 Vos=0 phimargin=45 en=0 enk=0 in=0 ink=0 Rin=500Meg  ; pins IN+ IN- V+ V- OUT
XU16 N055 N053 Vdd Vss N052 level.2 Avol=1Meg GBW=10Meg Slew=10Meg ilimit=25m rail=0 Vos=0 phimargin=45 en=0 enk=0 in=0 ink=0 Rin=500Meg  ; pins IN+ IN- V+ V- OUT
R63 N053 0 100k
R64 N052 N053 100k
R65 N054 0 100k
R66 N051 N054 100k
C33 N058 P015 1.68n
R67 P015 N012 82k
C34 N061 0 1.68n
R68 N061 P015 82k
R69 N057 P016 82k
C35 P016 N058 1.1n
C36 N062 P016 1.1n
R70 0 N062 82k
XU17 N062 N060 Vdd Vss N057 level.2 Avol=1Meg GBW=10Meg Slew=10Meg ilimit=25m rail=0 Vos=0 phimargin=45 en=0 enk=0 in=0 ink=0 Rin=500Meg  ; pins IN+ IN- V+ V- OUT
XU18 N061 N059 Vdd Vss N058 level.2 Avol=1Meg GBW=10Meg Slew=10Meg ilimit=25m rail=0 Vos=0 phimargin=45 en=0 enk=0 in=0 ink=0 Rin=500Meg  ; pins IN+ IN- V+ V- OUT
R71 N059 0 100k
R72 N058 N059 100k
R73 N060 0 100k
R74 N057 N060 100k
C37 N064 P017 1.68n
R75 P017 N012 56k
C38 N067 0 1.68n
R76 N067 P017 56k
R77 N063 P018 56k
C39 P018 N064 1.2n
C40 N068 P018 1.2n
R78 0 N068 56k
XU19 N068 N066 Vdd Vss N063 level.2 Avol=1Meg GBW=10Meg Slew=10Meg ilimit=25m rail=0 Vos=0 phimargin=45 en=0 enk=0 in=0 ink=0 Rin=500Meg  ; pins IN+ IN- V+ V- OUT
XU20 N067 N065 Vdd Vss N064 level.2 Avol=1Meg GBW=10Meg Slew=10Meg ilimit=25m rail=0 Vos=0 phimargin=45 en=0 enk=0 in=0 ink=0 Rin=500Meg  ; pins IN+ IN- V+ V- OUT
R79 N065 0 100k
R80 N064 N065 100k
R81 N066 0 100k
R82 N063 N066 100k
C41 N070 P019 6.7n
R83 P019 N012 10k
C42 N073 0 6.7n
R84 N073 P019 10k
R85 N069 P020 10k
C43 P020 N070 4.7n
C44 N074 P020 4.7n
R86 0 N074 10k
XU21 N074 N072 Vdd Vss N069 level.2 Avol=1Meg GBW=10Meg Slew=10Meg ilimit=25m rail=0 Vos=0 phimargin=45 en=0 enk=0 in=0 ink=0 Rin=500Meg  ; pins IN+ IN- V+ V- OUT
XU22 N073 N071 Vdd Vss N070 level.2 Avol=1Meg GBW=10Meg Slew=10Meg ilimit=25m rail=0 Vos=0 phimargin=45 en=0 enk=0 in=0 ink=0 Rin=500Meg  ; pins IN+ IN- V+ V- OUT
R87 N071 0 100k
R88 N070 N071 100k
R89 N072 0 100k
R90 N069 N072 100k
R91 P021 N012 100k
C45 N014 0 14.7n
C46 P021 N010 14.7n
R92 N014 P021 100k
XU23 N014 N013 Vdd Vss N010 level.2 Avol=1Meg GBW=10Meg Slew=10Meg ilimit=25m rail=0 Vos=0 phimargin=45 en=0 enk=0 in=0 ink=0 Rin=500Meg  ; pins IN+ IN- V+ V- OUT
R93 N013 0 100k
R94 N010 N013 100k
R95 N075 P022 10k
C47 P022 N012 4.7n
C48 N077 P022 4.7n
R96 0 N077 10k
XU24 N077 N076 Vdd Vss N075 level.2 Avol=1Meg GBW=10Meg Slew=10Meg ilimit=25m rail=0 Vos=0 phimargin=45 en=0 enk=0 in=0 ink=0 Rin=500Meg  ; pins IN+ IN- V+ V- OUT
R97 N076 0 100k
R98 N075 N076 100k
.ac oct 15 20 20000
.lib UniversalOpamps2.sub
.backanno
.end